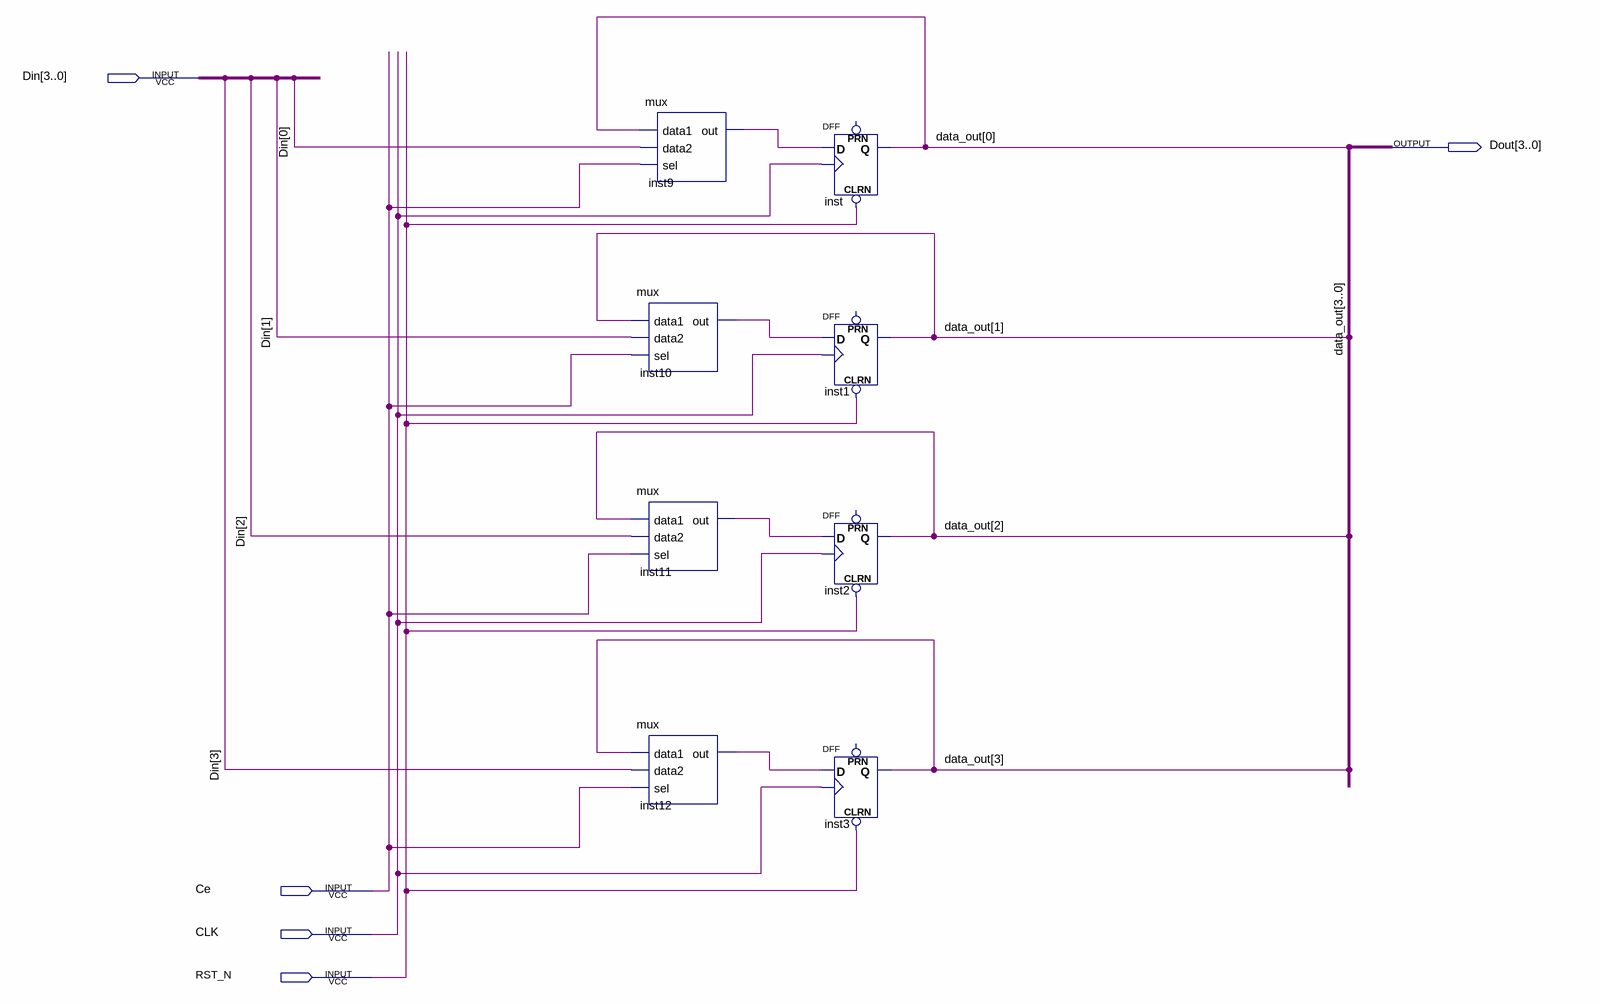
[diagram p0: schematic sheet]
// Quartus schematic four_bit_register.bdf as structural Verilog: 8 symbols, 5 pins
module four_bit_register (
  input  [3:0] Din,
  input  Ce,
  input  CLK,
  input  RST_N,
  output [3:0] Dout
);

  wire inst9_out, inst10_out, inst11_out, inst12_out;

  mux inst9 (.data1(Dout[0]), .data2(Din[0]), .sel(Ce), .out(inst9_out));
  mux inst10 (.data1(Dout[1]), .data2(Din[1]), .sel(Ce), .out(inst10_out));
  mux inst11 (.data1(Dout[2]), .data2(Din[2]), .sel(Ce), .out(inst11_out));
  mux inst12 (.data1(Dout[3]), .data2(Din[3]), .sel(Ce), .out(inst12_out));
  DFF inst (.CLRN(RST_N), .CLK(CLK), .D(inst9_out), .Q(Dout[0]));  // open: PRN
  DFF inst1 (.CLRN(RST_N), .CLK(CLK), .D(inst10_out), .Q(Dout[1]));  // open: PRN
  DFF inst2 (.CLRN(RST_N), .CLK(CLK), .D(inst11_out), .Q(Dout[2]));  // open: PRN
  DFF inst3 (.CLRN(RST_N), .CLK(CLK), .D(inst12_out), .Q(Dout[3]));  // open: PRN

  // Other names for the same wires on the sheet: data_out[3:0] = Dout
endmodule
